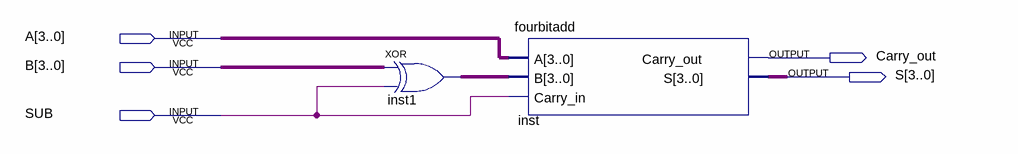
[diagram p0: schematic sheet]
// Quartus schematic addsub.bdf as structural Verilog: 2 symbols, 5 pins
module addsub (
  input  [3:0] A,
  input  [3:0] B,
  input  SUB,
  output Carry_out,
  output [3:0] S
);

  wire [3:0] inst1_out;

  assign inst1_out = B ^ {4{SUB}};  // XOR inst1, 4 bits wide
  fourbitadd inst (.A(A), .B(inst1_out), .Carry_in(SUB), .Carry_out(Carry_out), .S(S));
endmodule
